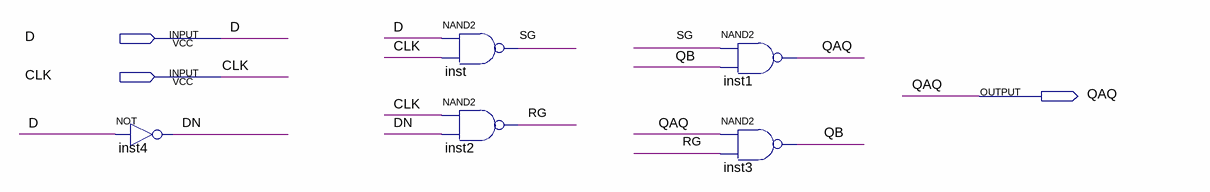
[diagram p0: schematic sheet]
// Quartus schematic Block1.bdf as structural Verilog: 5 symbols, 3 pins
module Block1 (
  input  D,
  input  CLK,
  output QAQ
);

  wire DN, QB, RG, SG;

  not inst4 (DN, D);
  nand inst (SG, D, CLK);
  nand inst2 (RG, CLK, DN);
  nand inst1 (QAQ, SG, QB);
  nand inst3 (QB, QAQ, RG);
endmodule
